# EAGLE schematic fbri_flight_straight (EAGLE 6.6.0)
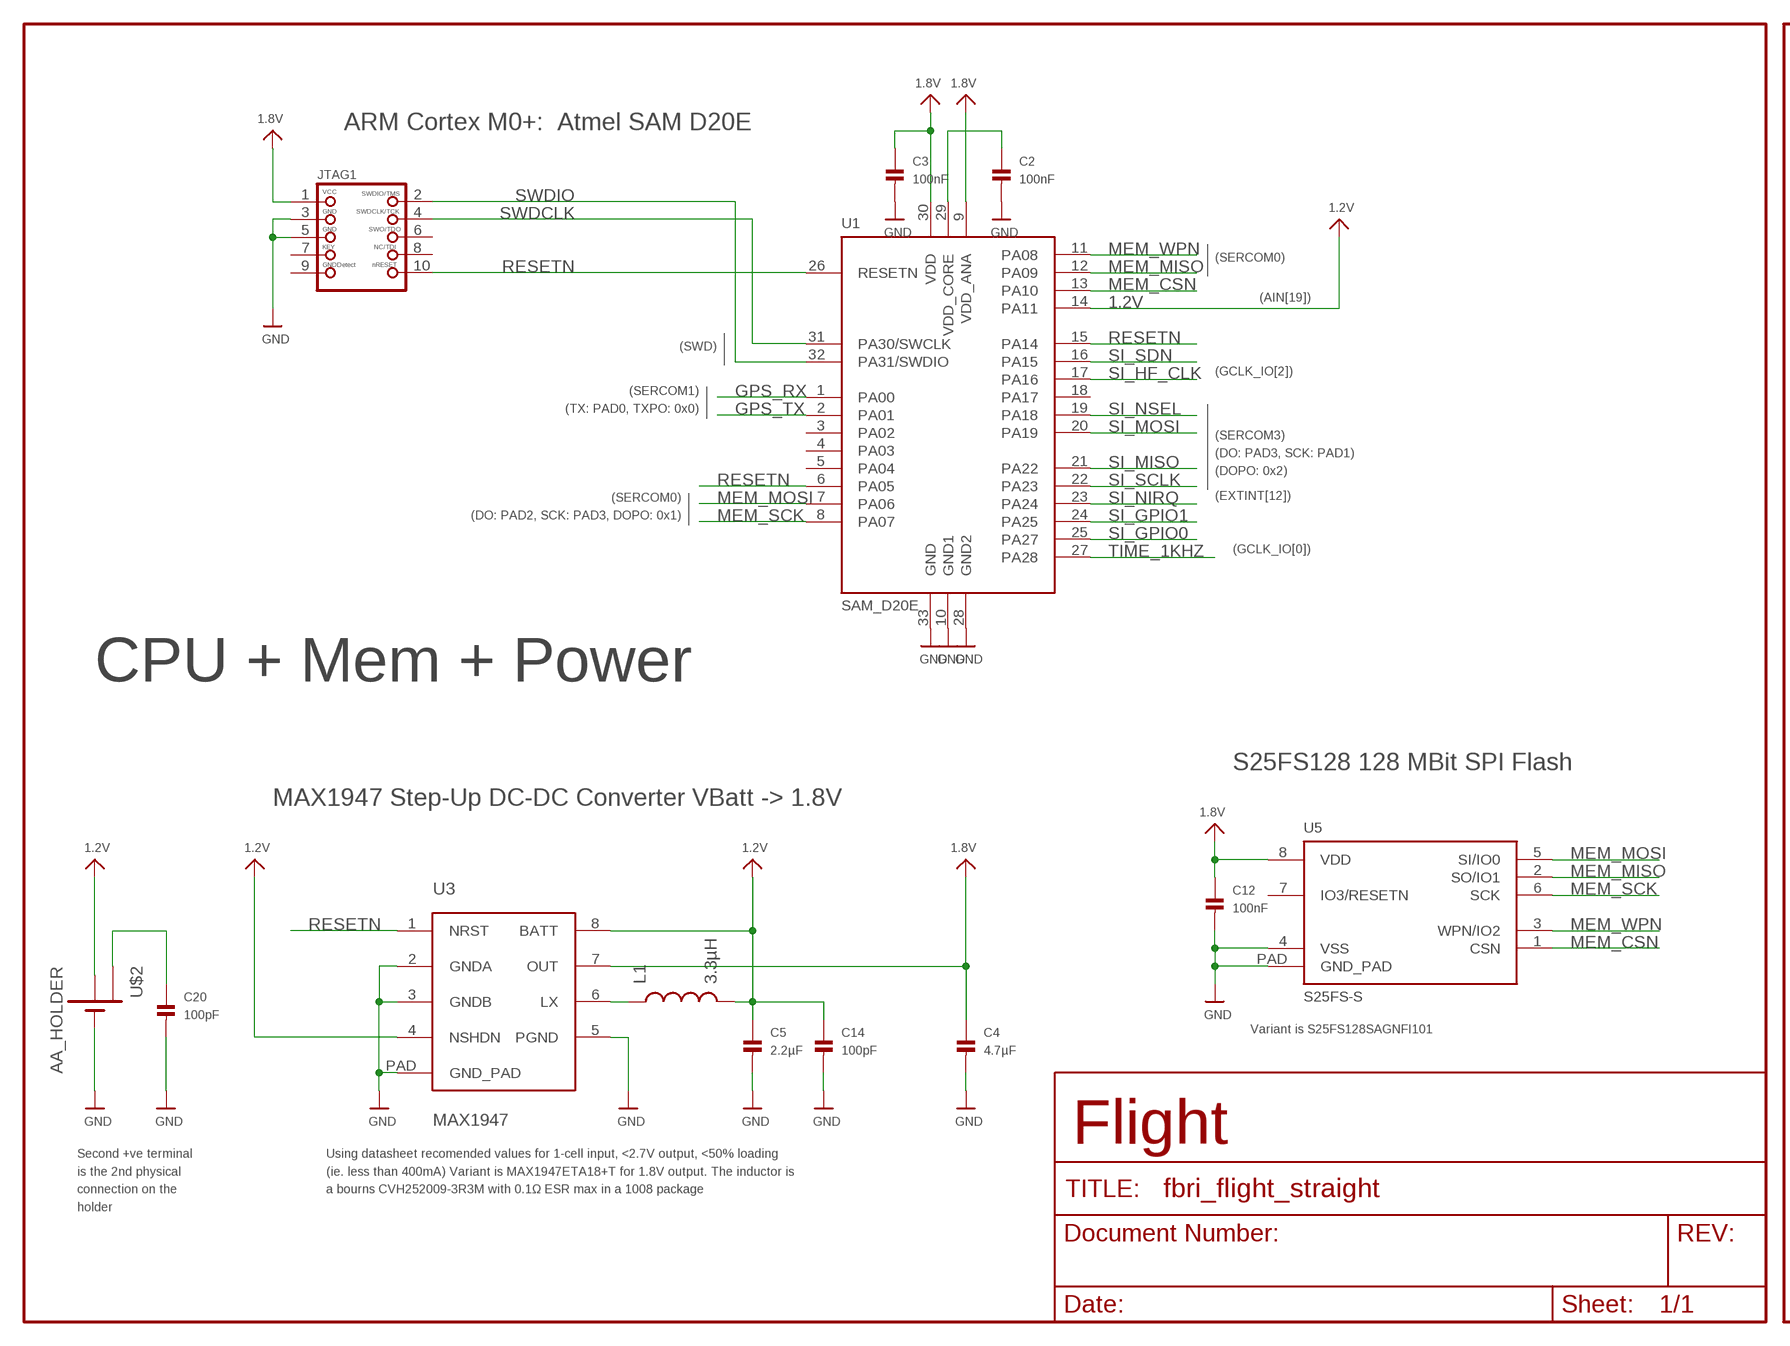
[diagram p0: schematic, sheet 1, part 1 of 2]
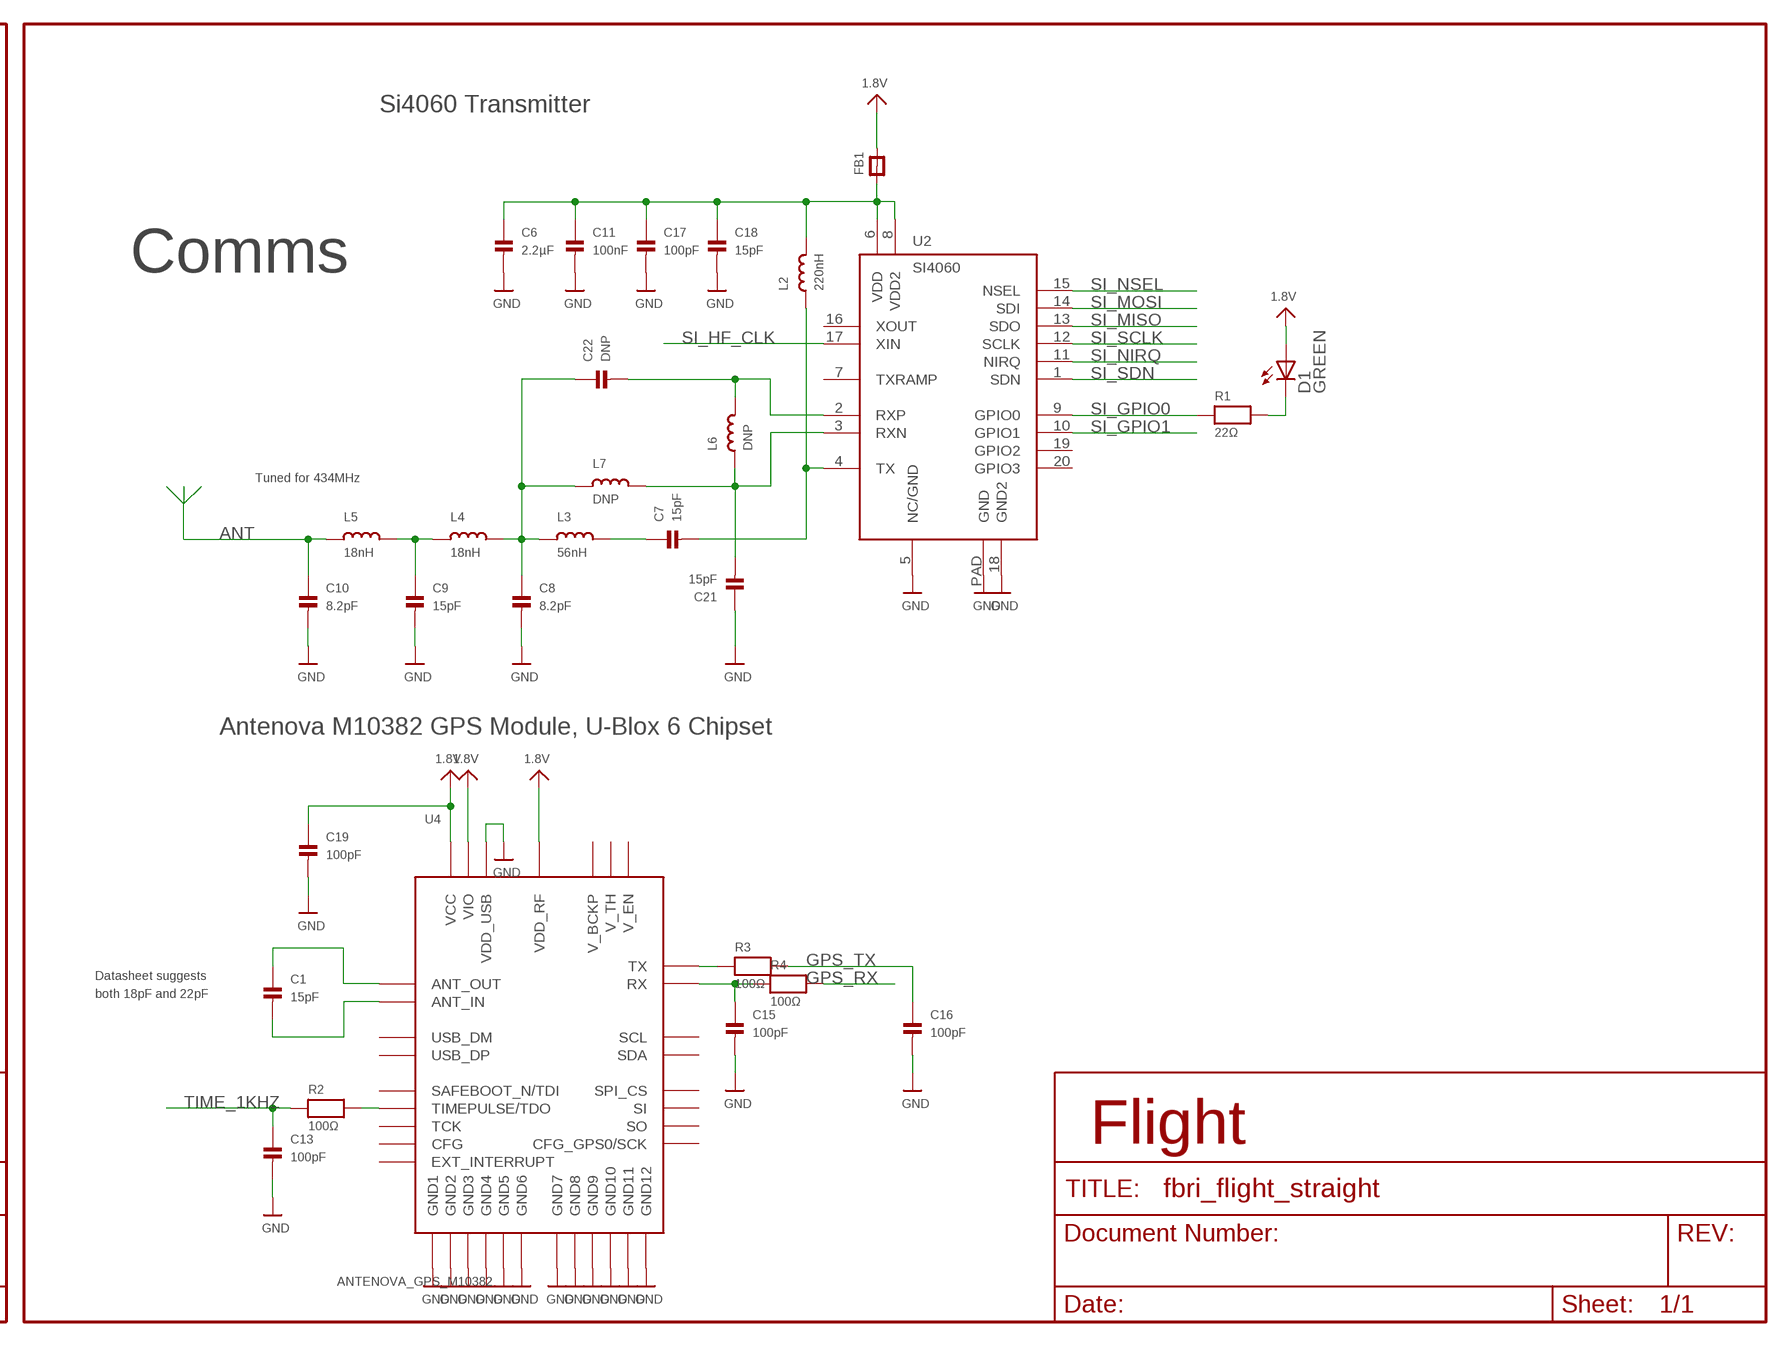
[diagram p1: schematic, sheet 1, part 2 of 2]

## Parts
C1  15pF  CAP_CERAMIC_0402  [_0402]
C2  100nF  CAP_CERAMIC_0402  [_0402]
C3  100nF  CAP_CERAMIC_0402  [_0402]
C4  4.7µF  CAP_CERAMIC_0402  [_0402]
C5  2.2µF  CAP_CERAMIC_0402  [_0402]
C6  2.2µF  CAP_CERAMIC_0402  [_0402]
C7  15pF  CAP_CERAMIC_0402  [_0402]
C8  8.2pF  CAP_CERAMIC_0402  [_0402]
C9  15pF  CAP_CERAMIC_0402  [_0402]
C10  8.2pF  CAP_CERAMIC_0402  [_0402]
C11  100nF  CAP_CERAMIC_0402  [_0402]
C12  100nF  CAP_CERAMIC_0402  [_0402]
C13  100pF  CAP_CERAMIC_0402  [_0402]
C14  100pF  CAP_CERAMIC_0402  [_0402]
C15  100pF  CAP_CERAMIC_0402  [_0402]
C16  100pF  CAP_CERAMIC_0402  [_0402]
C17  100pF  CAP_CERAMIC_0402  [_0402]
C18  15pF  CAP_CERAMIC_0402  [_0402]
C19  100pF  CAP_CERAMIC_0402  [_0402]
C20  100pF  CAP_CERAMIC_0402  [_0402]
C21  15pF  CAP_CERAMIC_0402  [_0402]
C22  DNP  CAP_CERAMIC_0402  [_0402]
D1  GREEN  LEDCHIPLED_0603  [CHIPLED_0603]
FB1  FERRITE_0402  [_0402]
JTAG1  JTAG-CORTEXM3SMT  [2X05_1.27MM_SMT]
L1  3.3µH  INDUCTOR1007  [1007]
L2  220nH  INDUCTOR_0402  [_0402]
L3  56nH  INDUCTOR_0402  [_0402]
L4  18nH  INDUCTOR_0402  [_0402]
L5  18nH  INDUCTOR_0402  [_0402]
L6  DNP  INDUCTOR_0402  [_0402]
L7  DNP  INDUCTOR_0402  [_0402]
R1  22Ω  RESISTOR_0402  [_0402]
R2  100Ω  RESISTOR_0402  [_0402]
R3  100Ω  RESISTOR_0402  [_0402]
R4  100Ω  RESISTOR_0402  [_0402]
U1  SAM_D20E  [QFN32_5MM]
U2  SI4060  [QFN20]
U3  MAX1947  [TDFN8]
U4  ANTENOVA_GPS_M10382  [ANTENOVA_GPS_M10382]
U5  S25FS-S  [WSON8]
U$2  AA_HOLDER  [AA]

## Nets
1.2V: C5.1 C14.1 L1.2 U1.14(PA11) U3.4(NSHDN) U3.8(BATT) U$2.+2(+)
1.8V: C3.1 C4.1 C12.1 C19.1 D1.A FB1.2 JTAG1.1 U1.9(VDD_ANA) U1.30(VDD) U3.7(OUT) U4.5_VIO(VIO) U4.25_VDD_RF(VDD_RF) U4.27_VCC(VCC) U5.8(VDD)
AN_GPS_RX: C15.1 R4.1 U4.13_RX(RX)
AN_GPS_TX: R3.1 U4.11_TX(TX)
ANT: C10.1 L5.1
FILTER1: C8.1 C22.1 L3.1 L4.2 L7.1
FILTER2: C9.1 L4.1 L5.2
GND: C2.2 C3.2 C4.2 C5.2 C6.2 C8.2 C9.2 C10.2 C11.2 C12.2 C13.2 C14.2 C15.2 C16.2 C17.2 C18.2 C19.2 C20.2 C21.1 JTAG1.3 JTAG1.5 U1.10(GND1) U1.28(GND2) U1.33(GND) U2.5(NC/GND) U2.18(GND2) U2.PAD(GND) U3.2(GNDA) U3.3(GNDB) U3.5(PGND) U3.PAD(GND_PAD) U4.2_GND(GND1) U4.4_GND(GND2) U4.14_GND(GND3) U4.17_GND(GND4) U4.21_GND(GND5) U4.24_GND(GND6) U4.26_GND(GND7) U4.28_GND(GND8) U4.32_VDD_USB(VDD_USB) U4.33_GND(GND9) U4.34_GND(GND10) U4.35_GND(GND11) U4.36_GND(GND12) U5.4(VSS) U5.PAD(GND_PAD) U$2.-1(-) U$2.-2(-)
GPS_ANT_IN: C1.2 U4.1_ANT_IN(ANT_IN)
GPS_ANT_OUT: C1.1 U4.3_ANT_OUT(ANT_OUT)
GPS_RX: R4.2 U1.1(PA00)
GPS_TX: C16.1 R3.2 U1.2(PA01)
LED_RES: D1.C R1.2
LX: L1.1 U3.6(LX)
MEM_CSN: U1.13(PA10) U5.1(CSN)
MEM_MISO: U1.12(PA09) U5.2(SO/IO1)
MEM_MOSI: U1.7(PA06) U5.5(SI/IO0)
MEM_SCK: U1.8(PA07) U5.6(SCK)
MEM_WPN: U1.11(PA08) U5.3(WPN/IO2)
N$1: C20.1 U$2.+1(+2)
RADIO_VDD: C6.1 C11.1 C17.1 C18.1 FB1.1 L2.2 U2.6(VDD) U2.8(VDD2)
RESETN: JTAG1.10 U1.6(PA05) U1.15(PA14) U1.26(RESETN) U3.1(NRST)
RF_OUT: C7.2 L2.1 U2.4(TX)
RXN: C21.2 L6.1 L7.2 U2.3(RXN)
RXP: C22.2 L6.2 U2.2(RXP)
SI_GPIO0: R1.1 U1.25(PA27) U2.9(GPIO0)
SI_GPIO1: U1.24(PA25) U2.10(GPIO1)
SI_HF_CLK: U1.17(PA16) U2.17(XIN)
SI_MISO: U1.21(PA22) U2.13(SDO)
SI_MOSI: U1.20(PA19) U2.14(SDI)
SI_NIRQ: U1.23(PA24) U2.11(NIRQ)
SI_NSEL: U1.19(PA18) U2.15(NSEL)
SI_SCLK: U1.22(PA23) U2.12(SCLK)
SI_SDN: U1.16(PA15) U2.1(SDN)
SWDCLK: JTAG1.4 U1.31(PA30/SWCLK)
SWDIO: JTAG1.2 U1.32(PA31/SWDIO)
TANK: C7.1 L3.2
TIME_1KHZ: C13.1 R2.1 U1.27(PA28)
TIME_1KHZ_DRIVE: R2.2 U4.23_TIMEPULSE/TDO(TIMEPULSE/TDO)
VDD_CORE: C2.1 U1.29(VDD_CORE)
Unconnected: JTAG1.6 JTAG1.7 JTAG1.8 JTAG1.9 U1.3(PA02) U1.4(PA03) U1.5(PA04) U1.18(PA17) U2.7(TXRAMP) U2.16(XOUT) U2.19(GPIO2) U2.20(GPIO3) U4.6_USB_DP(USB_DP) U4.7_USB_DM(USB_DM) U4.8_SO(SO) U4.9_CFG_GPS0_SCK(CFG_GPS0/SCK) U4.10_SPI_SELECT(SPI_CS) U4.12_V_TH(V_TH) U4.15_V_BCKUP(V_BCKP) U4.16_SI(SI) U4.18_SDA(SDA) U4.19_SCL(SCL) U4.20_SAFEBOOT_N/TDI(SAFEBOOT_N/TDI) U4.22_TCK(TCK) U4.29_EXT_INTERRUPT(EXT_INTERRUPT) U4.30_V_EN(V_EN) U4.31_CFG(CFG) U5.7(IO3/RESETN)

## Notes on the sheet
- Si4060 Transmitter
- ARM Cortex M0+:  Atmel SAM D20E
- (SERCOM0)
- Comms
- (AIN[19])
- (SWD)
- (GCLK_IO[2])
- (SERCOM1)
- (TX: PAD0, TXPO: 0x0)
- (SERCOM3)
- (DO: PAD3, SCK: PAD1)
- (DOPO: 0x2)
- Tuned for 434MHz
- (SERCOM0) | (EXTINT[12])
- (DO: PAD2, SCK: PAD3, DOPO: 0x1)
- (GCLK_IO[0])
- CPU + Mem + Power
- Antenova M10382 GPS Module, U-Blox 6 Chipset
- S25FS128 128 MBit SPI Flash
- MAX1947 Step-Up DC-DC Converter VBatt -> 1.8V
- Datasheet suggests
  both 18pF and 22pF
- Variant is S25FS128SAGNFI101
- Flight | Flight
- Using datasheet recomended values for 1-cell input, <2.7V output, <50% loading 
  (ie. less than 400mA) Variant is MAX1947ETA18+T for 1.8V output. The inductor is 
  a bourns CVH252009-3R3M with 0.1Ω ESR max in a 1008 package
- Second +ve terminal
  is the 2nd physical
  connection on the
  holder

## Library data of the parts
C1-C22 = microbuilder_v3:CAP_CERAMIC: Ceramic Capacitors 0402 - 0402 Surface Mount Capacitors 16pF 50V 5% [Digikey: 445-4899-2-ND] 18pF 50V 5% [Digikey: 490-1281-2-ND] 22pF 50V 5% [Digikey: 490-1283-2-ND] 68pF 50V 5% [Digikey: 490-1289-2-ND] 0.1uF 10V 10% [Digikey: 490-1318-2-ND] 1.0uF 6.3V 10% [Digikey: 490-1320-2-ND] 0603 - 0603 Surface Mount Capacitors 16 pF 50V 5% [Digikey: 445-5051-2-ND] 22 pF 50V [Digikey: PCC220ACVTR-ND] 33 pF 50V 5% [Digikey: 490-1415-1-ND] 56pF 50V 5% [Digikey: 490-1421-1-ND] 220pF 50V 5% [Digikey: 445-1285-1-ND] 680 pF 50V 2200 pF 50V 5% C0G [Digikey: 445-1297-1-ND] 5600 pF 100V 5% X7R [Digikey: 478-3711-1-ND] 0.1 µF 25V 10% [Digikey: PCC2277TR-ND] 0.22 µF 16V 10% X7R [Digikey: 445-1318-1-ND] 1.0 µF 25V 10% [Digikey: 445-5146-2-ND] 0603 - RF Specific 3pF 250V +/-0.1pF RF [Digikey: 712-1347-1-ND] 18 pF 250V 5% [Digikey: 478-3505-1-ND or 712-1322-1-ND] 56 pF 250V 5% C0G RF [Digikey: 490-4867-1-ND] 68 pF 250V RF [Digikey: 490-4868-1-ND] 0805 - 0805 Surface Mount Capacitors 220 pF 250V 2% RF Ceramic Capacitor [Digikey: 712-1398-1-ND] 1000 pF 50V 2% NP0 Ceramic Capacitor [Digikey: 478-3760-1-ND] 0.1 µF 25V 10% Ceramic Capacitor [Digikey: PCC1828TR-ND] 1.0 µF 16V 10% Ceramic Capacitor[Digikey: 490-1691-2-ND] 10.0 µF 10V 10% Ceramic Capacitor[Digikey: 709-1228-1-ND] 10.0 uF 16V 10% Ceramic Capacitor [Digikey: 478-5165-2-ND] 47 uF 6.3V 20% Ceramic Capacitor [Digikey: 587-1779-1-ND or 399-5506-1-ND] 1206 - 1206 Surface Mount Capacitors 47uF 10V 20% Ceramic Capacitor [Digikey: 490-5528-1-ND or 399-5508-1-ND or 445-6010-1-ND] 100uF 6.3V -20%, +80% Y5V Ceramic Capacitor (Digikey: 490-4512-1-ND, Mouser: 81-GRM31CF50J107ZE1L)
D1 = led:LED: LED OSRAM: - CHIPLED LG R971, LG N971, LY N971, LG Q971, LY Q971, LO R971, LY R971 LH N974, LH R974 LS Q976, LO Q976, LY Q976 LO Q996 - Hyper CHIPLED LW Q18S LB Q993, LB Q99A, LB R99A - SideLED LS A670, LO A670, LY A670, LG A670, LP A670 LB A673, LV A673, LT A673, LW A673 LH A674 LY A675 LS A676, LA A676, LO A676, LY A676, LW A676 LS A679, LY A679, LG A679 - Hyper Micro SIDELED® LS Y876, LA Y876, LO Y876, LY Y876 LT Y87S - SmartLED LW L88C, LW L88S LB L89C, LB L89S, LG L890 LS L89K, LO L89K, LY L89K LS L896, LA L896, LO L896, LY L896 - TOPLED LS T670, LO T670, LY T670, LG T670, LP T670 LSG T670, LSP T670, LSY T670, LOP T670, LYG T670 LG T671, LOG T671, LSG T671 LB T673, LV T673, LT T673, LW T673 LH T674 LS T676, LA T676, LO T676, LY T676, LB T676, LH T676, LSB T676, LW T676 LB T67C, LV T67C, LT T67C, LS T67K, LO T67K, LY T67K, LW E67C LS E67B, LA E67B, LO E67B, LY E67B, LB E67C, LV E67C, LT E67C LW T67C LS T679, LY T679, LG T679 LS T770, LO T770, LY T770, LG T770, LP T770 LB T773, LV T773, LT T773, LW T773 LH T774 LS E675, LA E675, LY E675, LS T675 LS T776, LA T776, LO T776, LY T776, LB T776 LHGB T686 LT T68C, LB T68C - Hyper Mini TOPLED® LB M676 - Mini TOPLED Santana® LG M470 LS M47K, LO M47K, LY M47K Source: http://www.osram.convergy.de LUXEON: - LUMILED® LXK2-PW12-R00, LXK2-PW12-S00, LXK2-PW14-U00, LXK2-PW14-V00 LXK2-PM12-R00, LXK2-PM12-S00, LXK2-PM14-U00 LXK2-PE12-Q00, LXK2-PE12-R00, LXK2-PE12-S00, LXK2-PE14-T00, LXK2-PE14-U00 LXK2-PB12-K00, LXK2-PB12-L00, LXK2-PB12-M00, LXK2-PB14-N00, LXK2-PB14-P00, LXK2-PB14-Q00 LXK2-PR12-L00, LXK2-PR12-M00, LXK2-PR14-Q00, LXK2-PR14-R00 LXK2-PD12-Q00, LXK2-PD12-R00, LXK2-PD12-S00 LXK2-PH12-R00, LXK2-PH12-S00 LXK2-PL12-P00, LXK2-PL12-Q00, LXK2-PL12-R00 Source: www.luxeon.com KINGBRIGHT: KA-3528ASYC Source: www.kingbright.com
FB1 = microbuilder_v3:FERRITE: Ferrite Bead 0603 MMZ1608B121C - 120 Ohm @ 100MHz, 600mA, 0.15 Ohm DC Resistance - Digikey: 445-2164-1-ND BK1608HW121-T - 120 Ohm, 600mA Ferrite Chip - Digikey: 587-1876-2-ND 0805 HZ0805B272R-10 - 2.7K Ohm @ 100MHz, 200mA, 0.8 Ohm DC Resistance - Digikey: 240-2504-1-ND (see also Murata BLM21BD272SN1L) MMZ2012Y152B - 1.5K Ohm @ 100MHz, 500mA, 0.4 Ohm DC Resistance - Digikey: 445-1560-1-ND - Mainly for high frequency (80-400MHz) MMZ2012R102A - 1K Ohm @ 100MHz, 500mA, 0.3 Ohm DC Resistance - Digikey: 445-1555-2-ND - More general purpose (10-200MHz)
JTAG1 = microbuilder_v3:JTAG-CORTEXM3: Serial Wire (SW-DP) Connector This standard 0.05" 10-pin connector is for use with the Cortex M0/M3's native SWD (serial wire debugger) interface (SW-DP). Some boards support a 20-pin combined JTAG+SWD connector (SWJ-DP), such as the LPC1700 family, but many smaller devices only work with SWD which typically use the smaller 10-pin SW-DP connecter (the LPC1300 family, for example, only supports SWD). 2x05 1.27mm/0.05" Connector: This is the standard SMT connector defined by ARM for all Cortex devices, and should be used in most situations and for forward-compatibility since any new devices coming to market will likely use this connector. MOLEX 10 Pin 0.1" Connector: This 0.1" 10 pin connector has the same pin layout as the standard 0.05" connector, but is easier to work with if you are using standard jumper wires or custom cables to connect your SWD hardware. MOLEX 20 Pin 0.1" Connector: This 0.1" 20 pin connector is the same model used for ARM7/ARM9 JTAG debuggers, but is connected to match the pins on the Segger J-Link for ARM (which supports both JTAG and SWD debugging). See the following document from ARM for more information on Cortex M3 Debug Connectors: http://infocenter.arm.com/help/topic/com.arm.doc.faqs/attached/13634/cortex_debug_connectors.pdf And the following page for an overview with images of the different connector types: http://www.keil.com/peripherals/coresight/connectors.asp
L1 = SparkFun:INDUCTOR: Inductors
L2-L7 = microbuilder_v3:INDUCTOR: Inductors
R1-R4 = microbuilder_v3:RESISTOR: Resistors 0402 - 0402 Surface Mount Package 22 Ohm 1% 1/16W [Digikey: 311-22.0LRTR-ND] 33 Ohm 5% 1/16W 1.0K 5% 1/16W 1.5K 5% 1/16W 2.0K 1% 1/16W 10.0K 1% 1/16W [Digikey: 311-10.0KLRTR-ND] 10.0K 5% 1/16W [Digikey: RMCF0402JT10K0TR-ND] 12.1K 1% 1/16W [Digikey: 311-22.0LRTR-ND] 100.0K 5% 1/16W 0603 - 0603 Surface Mount Package 0 Ohm 1/10 Watt 1% Resistor 15 Ohm 1/10 Watt 1% Resistor 33 Ohm 1/10 Watt 1% Resistor 49.9 Ohm 1/10 Watt 1% Resistor 100 Ohm 1/10 Watt 1% Resistor 150 Ohm 1/10 Watt 1% Resistor 240 Ohm 1/10 Watt 1% Resistor 390 Ohm 1/10 Watt 1% Resistor 560 Ohm 1/10 Watt 1% Resistor 680 Ohm 1/10 Watt 1% Resistor 750 Ohm 1/10 Watt 1% Resistor 1.0K Ohm 1/10 Watt 1% Resistor 1.5K Ohm 1/10 Watt 1% Resistor 2.0K Ohm 1/10 Watt 1% Resistor 2.2K Ohm 1/10 Watt 1% Resistor 3.3K Ohm 1/10 Watt 1% Resistor 4.7K Ohm 1/10 Watt 1% Resistor 10.0K Ohm 1/10 Watt 1% Resistor 12.0K Ohm 1/10 Watt 1% Resistor 12.1K Ohm 1/10 Watt 1% Resistor 20.0K Ohm 1/10 Watt 1% Resistor 33.0K Ohm 1/10 Watt 1% Resistor 100.0K Ohm 1/10 Watt 1% Resistor 0805 - 0805 Surface Mount Package 0 Ohm 1/8 Watt 1% Resistor 33 Ohm 1/8 Watt 1% Resistor 100 Ohm 1/8 Watt 1% Resistor 150 Ohm 1/8 Watt 1% Resistor 200 Ohm 1/8 Watt 1% Resistor 240 Ohm 1/8 Watt 1% Resistor 330 Ohm 1/8 Watt 1% Resistor 390 Ohm 1/8 Watt 1% Resistor 470 Ohm 1/8 Watt 1% Resistor 1.0K Ohm 1/8 Watt 1% Resistor 1.5K Ohm 1/8 Watt 1% Resistor 2.0K Ohm 1/8 Watt 1% Resistor 4.7K Ohm 1/8 Watt 1% Resistor 5.1K Ohm 1/8 Watt 1% Resistor 5.6K Ohm 1/8 Watt 1% Resistor 10.0K Ohm 1/8 Watt 1% Resistor 22.0K Ohm 1/8 Watt 1% Resistor 33.0K Ohm 1/8 Watt 1% Resistor 100K Ohm 1/8 Watt 1% Resistor 1206 - 1206 Surface Mount Package 2012 - 2010 Surface Mount Package 0.11 Ohm 1/2 Watt 1% Resistor - Digikey: RHM.11UCT-ND
U1 = fbri:SAM_D20E
U2 = fbri:SI4060
U3 = fbri:MAX1947
U4 = fbri:ANTENOVA_GPS_M10382
U5 = fbri:S25FS-S
U$2 = fbri:AA_HOLDER